# EasyEDA Pro project Project_Hackathon_PCB.epro

# Schematic Main_Board
Create Date: 2024-02-26; Page Name: P1; Project Name: Hackathon; Schematic Name: Main_Board; Update Date: 2024-03-01; Company: HACKATHON; Drawn: EasyEDA; Page Size: A3; Part Number: JLCPCB-002; Reviewed: EasyEDA; Version: V0.1
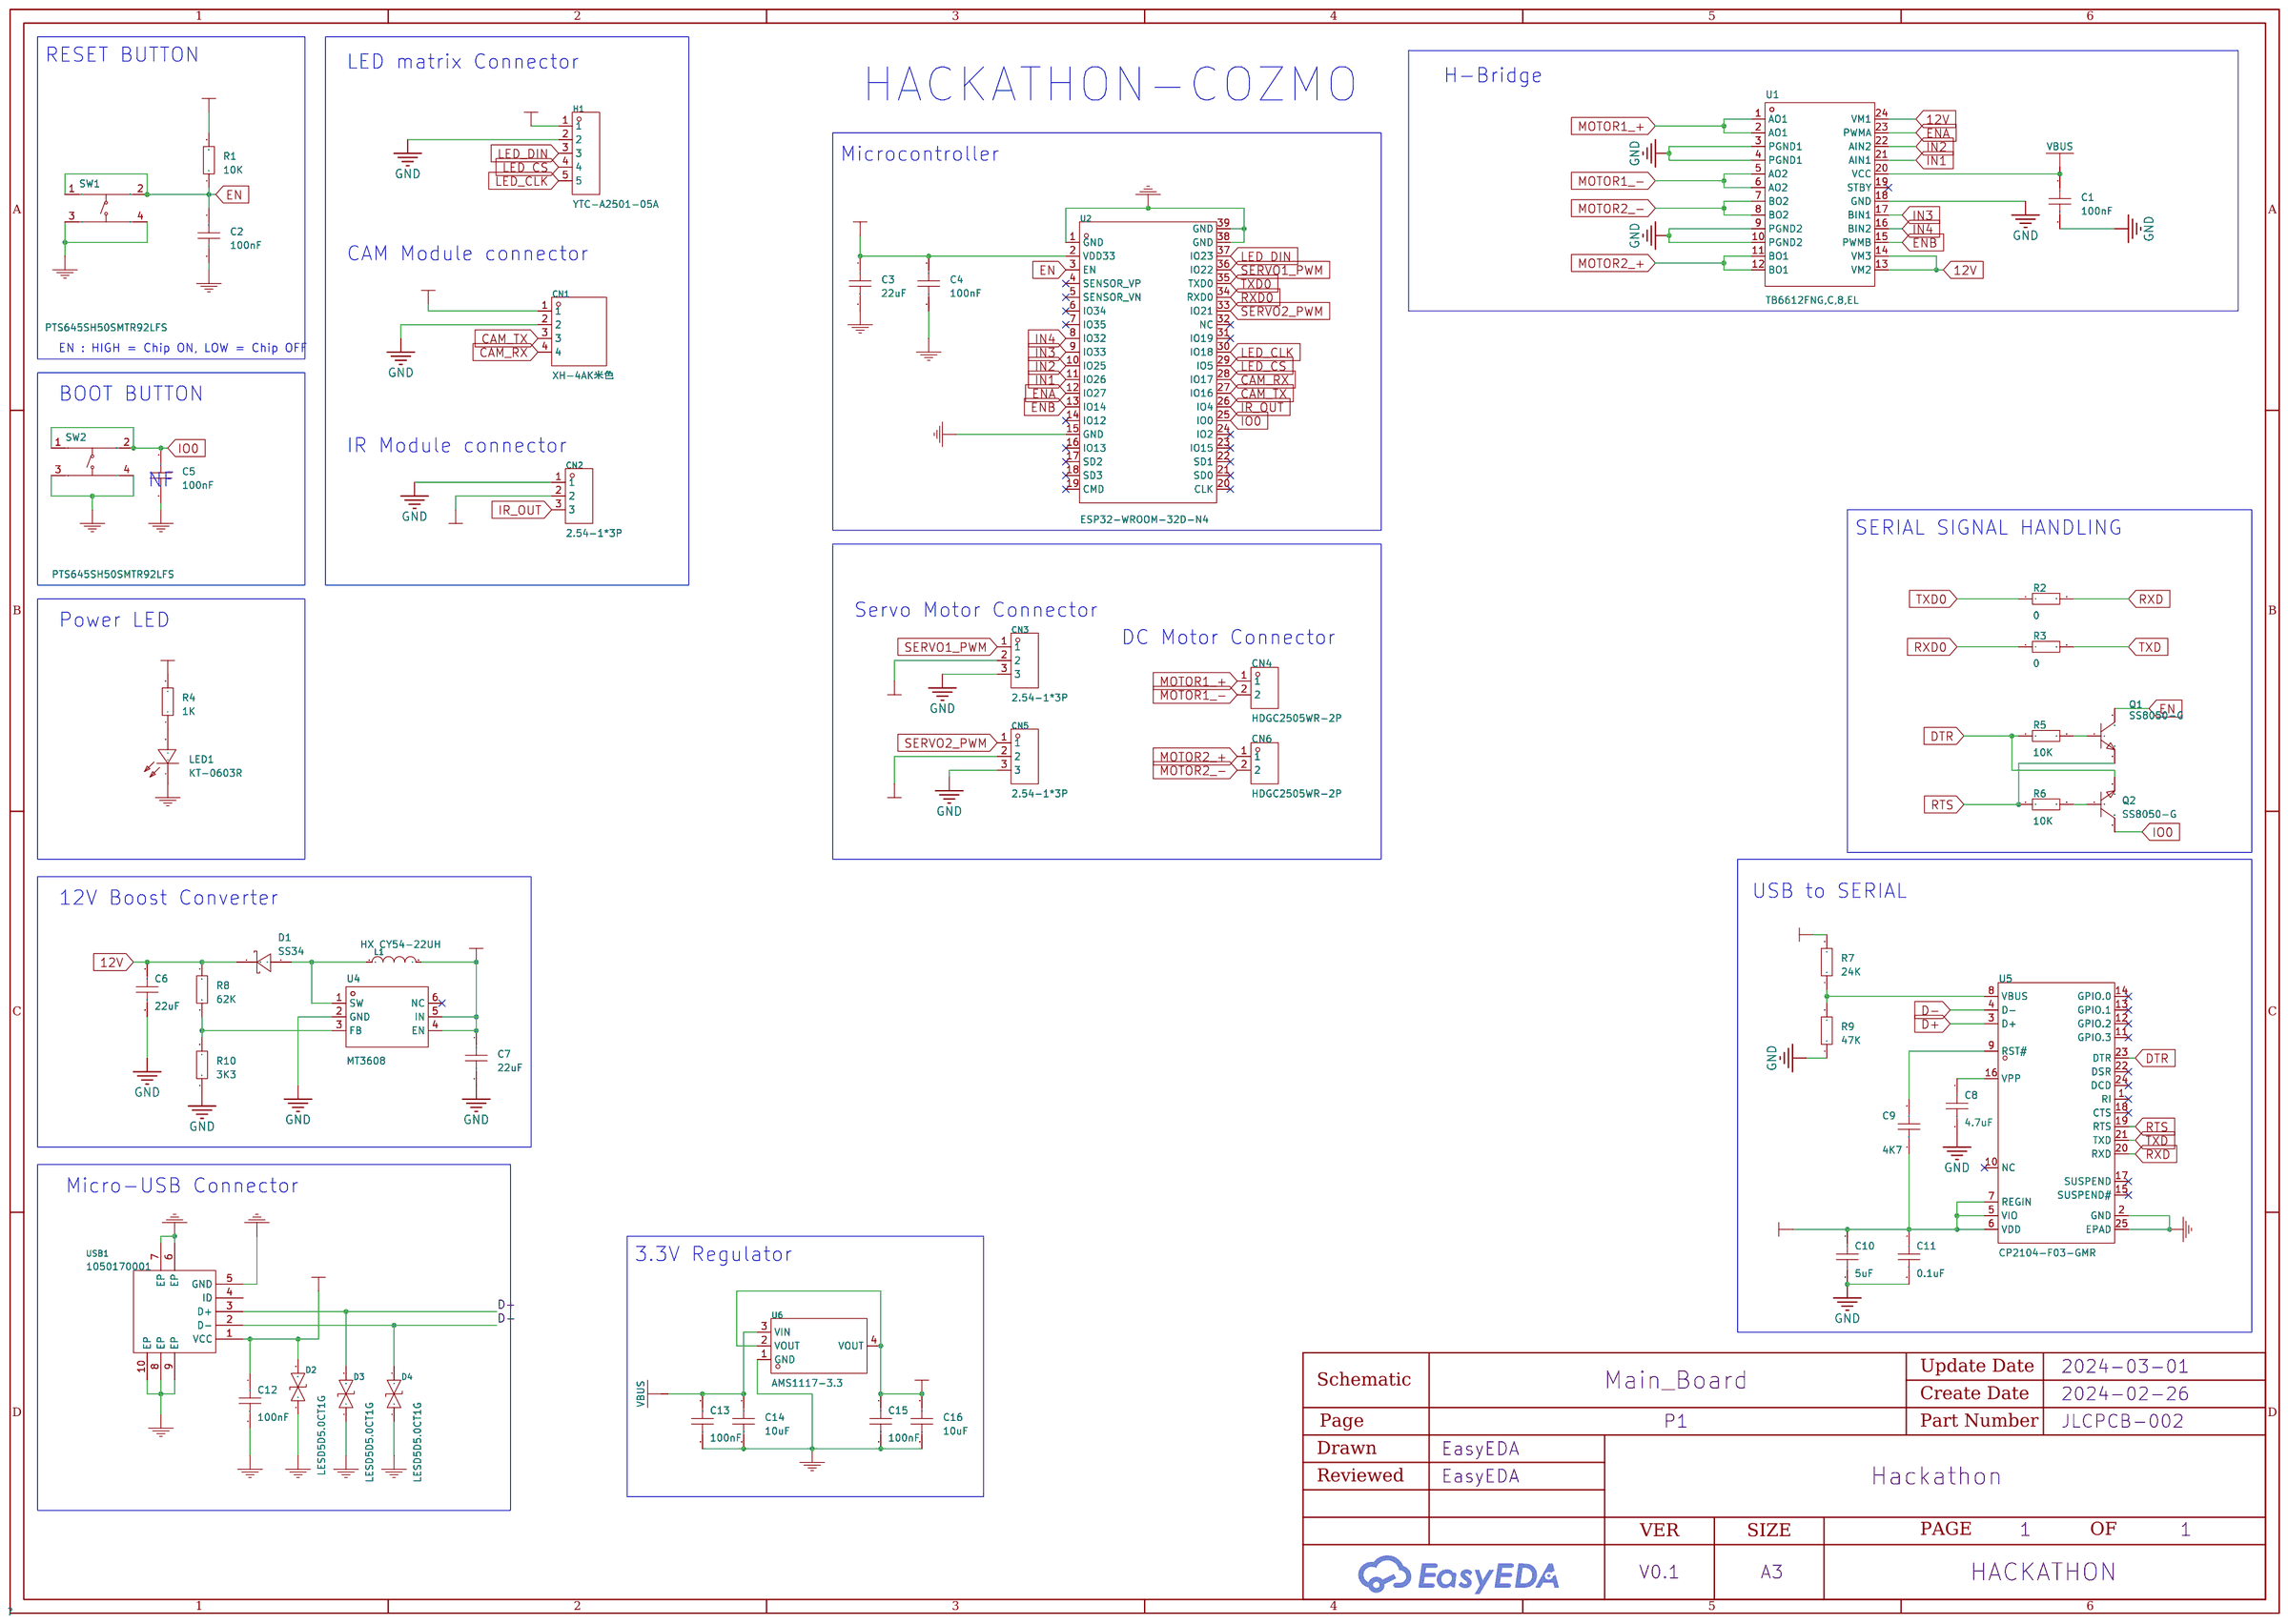
[diagram p0: schematic sheet]

## Parts
C1  100nF  [C0603]
C2  100nF  [C0603]
C3  22uF  [C0603]
C4  100nF  [C0603]
C5  100nF  [C0603]  (no BOM)
C6  22uF  [C0603]
C7  22uF  [C0603]
C8  4.7uF  [C0603]
C9  4K7  [C0603]
C10  5uF  [C0603]
C11  0.1uF  [C0603]
C12  100nF  [C0603]
C13  100nF  [C0603]
C14  10uF  [C0603]
C15  100nF  [C0603]
C16  10uF  [C0603]
CN1  XH-4AK米色  [CONN-TH_4P-P2.50_XH-4A]
CN2  2.54-1*3P  [CONN-TH_C722693]
CN3  2.54-1*3P  [CONN-TH_C722693]
CN4  HDGC2505WR-2P  [CONN-TH_HDGC2505WR-2P]
CN5  2.54-1*3P  [CONN-TH_C722693]
CN6  HDGC2505WR-2P  [CONN-TH_HDGC2505WR-2P]
D1  SS34  [SMC_L6.9-W5.9-LS7.9-RD]
D2  LESD5D5.0CT1G  [SOD-523_L1.2-W0.8-LS1.6-BI]
D3  LESD5D5.0CT1G  [SOD-523_L1.2-W0.8-LS1.6-BI]
D4  LESD5D5.0CT1G  [SOD-523_L1.2-W0.8-LS1.6-BI]
H1  YTC-A2501-05A  [HDR-TH_5P-P2.50-V-F-2]
L1  HX CY54-22UH  [IND-SMD_L5.8-W5.2_SLF05XX]
LED1  KT-0603R  [LED0603-RD]
Q1  SS8050-G  [SOT-23-3_L2.9-W1.3-P1.90-LS2.4-BR]
Q2  SS8050-G  [SOT-23-3_L2.9-W1.3-P1.90-LS2.4-BR]
R1  10K  [R0603]
R2  0  [R0603]
R3  0  [R0603]
R4  1K  [R0603]
R5  10K  [R0603]
R6  10K  [R0603]
R7  24K  [R0603]
R8  62K  [R0603]
R9  47K  [R0603]
R10  3K3  [R0603]
SW1  PTS645SH50SMTR92LFS  [KEY-SMD_4P-L6.0-W6.0-P4.50-LS9.0]
SW2  PTS645SH50SMTR92LFS  [KEY-SMD_4P-L6.0-W6.0-P4.50-LS9.0]
U1  TB6612FNG,C,8,EL  [SSOP-24_L8.3-W5.6-P0.65-LS7.6-BL]
U2  ESP32-WROOM-32D-N4  [WIFIM-SMD_39P-L25.5-W18.0-P1.27-BL]
U4  MT3608  [SOT-23-6_L2.9-W1.6-P0.95-LS2.8-BL]
U5  CP2104-F03-GMR  [QFN-24_L4.0-W4.0-P0.50-BL-EP2.7]
U6  AMS1117-3.3  [SOT-223-3_L6.5-W3.4-P2.30-LS7.0-BR]
USB1  1050170001  [MICRO-USB-SMD_105017-0001]

## Library data of the parts
C1-C16 = CAP_0603: Supplier Footprint: 0603
CN1 = XH-4AK米色: Pins Structure:1x4P Pitch:2.5mm Mounting Style:- Reference Series:XH Number of Pins:4P Number of Rows:1 Number of PINs Per Row:4 Row Spacing:- Contact Material:-; LCSC Part Name: 系列:XH 间距:2.5mm 1x4P; Supplier Part: C146106; Manufacturer: BOOMELE(博穆精密); Supplier Footprint: 插件,P=2.5mm; JLCPCB Part Class: Extended Part; Datasheet: https://atta.szlcsc.com/upload/public/pdf/source/20201225/C146106_214F8CD598ED20EDC5CBB211FD7DC82D.pdf; Supplier: LCSC; Pins Structure: 1x4P; Pitch: 2.5mm; Reference Series: XH; Number of Pins: 4P; Number of Rows: 1; Number of PINs Per Row: 4
CN2 CN3 CN5 = 2.54-1*3P: Pins Structure:1x3P Pitch:2.5mm Mounting Style:Straight Reference Series:- Number of Pins:3P Number of Rows:1 Number of PINs Per Row:3 Row Spacing:- Current Rating (Max):2A Operating Temperature Range:-25℃~+85℃ Operating Temperature Range:-25℃~+85℃; LCSC Part Name: 1x3P 间距:2.5mm 直插; Supplier Part: C722693; Manufacturer: CAX(创都); Supplier Footprint: 插件,P=2.5mm; JLCPCB Part Class: Extended Part; Datasheet: https://atta.szlcsc.com/upload/public/pdf/source/20200828/C722882_77827A18A6E0E346E9D9EABFEFB0E3A6.pdf; Supplier: LCSC; Pins Structure: 1x3P; Pitch: 2.5mm; Mounting Style: Straight; Number of Pins: 3P; Number of Rows: 1; Number of PINs Per Row: 3; Current Rating (Max): 2A; Operating Temperature Range: -25℃~+85℃
CN4 CN6 = HDGC2505WR-2P: Pins Structure:1x2P Mounting Style:Right-Angle Number of Pins:2P Number of Rows:1 Number of PINs Per Row:2; Supplier Part: C5276882; Manufacturer: HDGC(华德共创); Supplier Footprint: 弯插; JLCPCB Part Class: Extended Part; Datasheet: https://atta.szlcsc.com/upload/public/pdf/source/20221125/BC44EB8DA27E74234A82FA1DB1382351.pdf; Supplier: LCSC; Pins Structure: 1x2P; Mounting Style: Right-Angle; Number of Pins: 2P; Number of Rows: 1; Number of PINs Per Row: 2
D1 = SS34_C169162: Forward Voltage (Vf@If):500mV@3A Reverse Voltage (Vr):40V Average Rectified Current (Io):3A; LCSC Part Name: 电压:40V 电流:3A; Supplier Part: C169162; Supplier Footprint: SMC(DO-214AB); JLCPCB Part Class: Extended Part; Datasheet: https://atta.szlcsc.com/upload/public/pdf/source/20180130/C169162_15172974043501323414.pdf; Supplier: LCSC; Forward Voltage (Vf@If): 500mV@3A; Reverse Voltage (Vr): 40V; Average Rectified Current (Io): 3A
D2-D4 = LESD5D5.0CT1G: polarity:Bi-Directional Reverse Stand-Off Voltage (Vrwm):5V Maximum Clamping Voltage:18.6V Peak Pulse Current (Ipp)@10/1000us:9.4A Breakdown Voltage:5.6V Type:ESD; LCSC Part Name: 双向ESD; Supplier Part: C383211; Manufacturer: LRC(乐山无线电); Supplier Footprint: SOD-523; JLCPCB Part Class: Extended Part; Datasheet: https://atta.szlcsc.com/upload/public/pdf/source/20190807/C383211_633DF4B4E2C161403226E5235FE33A1C.pdf; Supplier: LCSC; polarity: Bi-Directional; Reverse Stand-Off Voltage (Vrwm): 5V; Maximum Clamping Voltage: 18.6V; Peak Pulse Current (Ipp)@10/1000us: 9.4A; Breakdown Voltage: 5.6V; Type: ESD
H1 = YTC-A2501-05A: Pins Structure:1x5P Pitch:2.5mm Mounting Style:Straight Reference Series:XH Number of Pins:5P Number of Rows:1 Number of PINs Per Row:5; LCSC Part Name: XH 2.5mm 1x5P直插; Supplier Part: C7436591; Manufacturer: YIYUAN(怡远); Supplier Footprint: P=2.5mm; Datasheet: https://atta.szlcsc.com/upload/public/pdf/source/20230703/1023D4BED328BFC36CE2087683F9B405.pdf; Supplier: LCSC; Pins Structure: 1x5P; Pitch: 2.5mm; Mounting Style: Straight; Reference Series: XH; Number of Pins: 5P; Number of Rows: 1; Number of PINs Per Row: 5
L1 = HX CY54-22UH: LCSC Part Name: 功率/贴片电感 22uH ±10% 直流电阻(DCR):169mΩ 电感值:22uH 精度:±10% 额定电流:1.1A; Supplier Part: C5362904; Manufacturer: hanxia(韩下); Supplier Footprint: SMD; Datasheet: https://atta.szlcsc.com/upload/public/pdf/source/20230221/557EFBE01350101F4F8CD3AD3B454D9E.pdf; Supplier: LCSC
LED1 = KT-0603R: Emitted Color:Red Power Dissipation:- Forward Current:- Dominant Wavelength:- Dominant Wavelength:- Peak Wavelength:- Diode Configuration:- Lens Color:- Color Temperature:- Color Temperature:- Viewing Angle:- Mounting Sytle:- Operating Temperature:-40℃~+8; LCSC Part Name: 0603 红灯 高亮; Supplier Part: C2286; Manufacturer: KENTO; Supplier Footprint: 0603; JLCPCB Part Class: Basic Part; Datasheet: https://atta.szlcsc.com/upload/public/pdf/source/20160616/1466072038404.pdf; Supplier: LCSC; Emitted Color: Red; Operating Temperature: -40℃~+85℃
Q1 Q2 = SS8050-G: Transistor Type: Collector Current (Ic): Collector-Emitter Breakdown Voltage (Vceo): Power Dissipation (Pd): DC Current Gain (hFE@Ic,Vce):200@100mA,1V DC Current Gain (hFE@Ic,Vce):200@100mA,1V Transition Frequency (fT):100MHz Collector Cut-Off Current (Ic; LCSC Part Name: NPN 电流:1.5A 耐压:25V H档(200-350); Supplier Part: C164885; Manufacturer: CJ(江苏长电/长晶); Supplier Footprint: SOT-23; JLCPCB Part Class: Extended Part; Datasheet: https://atta.szlcsc.com/upload/public/pdf/source/20180130/C177739_15172974524031323483.pdf; Supplier: LCSC; DC Current Gain (hFE@Ic,Vce): 200@100mA,1V; Transition Frequency (fT): 100MHz; Collector Cut-Off Current (Icbo): 100nA; Collector-Emitter Saturation Voltage (VCE(sat)@Ic,Ib): 500mV@800mA,80mA
R1-R10 = Res_0603: Supplier Footprint: 0603
SW1 SW2 = PTS645SH50SMTR92LFS: Circuit:SPST Actuator Style:Round Button Operating Force:200gf Mounting Style:Brick nogging Switch Length:6mm Switch Width:6mm Switch Height:5mm Contact Current:50mA Voltage Rating (DC):12V With Lamp:- Pin Style:Gull Wing Mechanical Life:- Operating Tempe; LCSC Part Name: 6*6*5mm 立贴 轻触开关; Supplier Part: C221869; Manufacturer: C&K; Supplier Footprint: SMD,6x6mm; JLCPCB Part Class: Extended Part; Datasheet: https://atta.szlcsc.com/upload/public/pdf/source/20190108/C285530_E89B379DE8DD14E424006A6061D0203A.pdf; Supplier: LCSC; Circuit: SPST; Actuator Style: Round Button; Operating Force: 200gf; Mounting Style: Brick nogging; Switch Length: 6mm; Switch Width: 6mm; Switch Height: 5mm; Contact Current: 50mA; Voltage Rating (DC): 12V; Pin Style: Gull Wing; Operating Temperature: -40℃~+85℃
U1 = TB6612FNG,C,8,EL: Drive motor type:有刷直流电机 Supply Voltage:2.7V~5.5V Supply Voltage:2.7V~5.5V Output Current:1A Interface:Parallel Operating Temperature:-20℃~+85℃@(Ta) Operating Temperature:-20℃~+85℃@(Ta); LCSC Part Name: 1A 有刷直流电机驱动芯片 5.5V; Supplier Part: C141517; Manufacturer: TOSHIBA(东芝); Supplier Footprint: SSOP-24; JLCPCB Part Class: Extended Part; Datasheet: https://atta.szlcsc.com/upload/public/pdf/source/20171128/C141517_15118625624231147036.pdf; Supplier: LCSC; Drive motor type: 有刷直流电机; Supply Voltage: 2.7V~5.5V; Output Current: 1A; Interface: Parallel; Operating Temperature: -20℃~+85℃@(Ta)
U2 = ESP32-WROOM-32D-N4: LCSC Part Name: 通用型Wi-Fi+BT+BLE MCU模组; Supplier Part: C473012; Manufacturer: ESPRESSIF(乐鑫); Supplier Footprint: SMD,18x25.5mm; JLCPCB Part Class: Extended Part; Datasheet: https://atta.szlcsc.com/upload/public/pdf/source/20191225/C473012_1E74417EE995DBCF17C94BD318A37DAB.pdf; Supplier: LCSC
U4 = MT3608: Function:boost converterType Input Voltage:2V~24V Input Voltage:2V~24V Output Voltage:28V Output Voltage:28V Output Current (Max):- Switching Frequency:1.2MHz Synchronous Rectification:- Number of Outputs:1 Topology:Boost Switch tube (built-in/external):内; Supplier Part: C84817; Manufacturer: 西安航天民芯; Supplier Footprint: SOT-23-6; JLCPCB Part Class: Extended Part; Datasheet: https://atta.szlcsc.com/upload/public/pdf/source/20161110/1478743351706.pdf; Supplier: LCSC; Function: boost converterType; Input Voltage: 2V~24V; Output Voltage: 28V; Switching Frequency: 1.2MHz; Number of Outputs: 1; Topology: Boost; Switch tube (built-in/external): 内置
U5 = CP2104-F03-GMR_C47742: Applications Function:USB转UART Protocol:UART Supply Voltage:1.8V；3V~3.6V Supply Voltage:1.8V；3V~3.6V Data Rate:2Mbps Operating Temperature:-40℃~+85℃ Operating Temperature:-40℃~+85℃; LCSC Part Name: USB转UART桥接芯片; Supplier Part: C47742; Manufacturer: SKYWORKS/SILICON LABS(芯科); Supplier Footprint: QFN-24-EP(4x4); JLCPCB Part Class: Extended Part; Datasheet: https://atta.szlcsc.com/upload/public/pdf/source/20150504/1457707282429.pdf; Supplier: LCSC; Applications Function: USB转UART; Protocol: UART; Supply Voltage: 1.8V；3V~3.6V; Data Rate: 2Mbps; Operating Temperature: -40℃~+85℃
U6 = AMS1117-3.3_C6186: Output Type: Maximum Input Voltage:- Output Voltage:3.3V Output Voltage:3.3V MAX Output Current:1A Power Supply Rejection Ratio (PSRR):72dB@(120Hz) Dropout Voltage:1.3V@(800mA) standby current:- Noise:- Feature:- Operating Temperature:- Operating Temperat; LCSC Part Name: 输出3.3V 1A; Supplier Part: C6186; Manufacturer: AMS; Supplier Footprint: SOT-223-3; JLCPCB Part Class: Basic Part; Datasheet: https://atta.szlcsc.com/upload/public/pdf/source/20180727/C6186_7A095716F0823C02F1997A905E26C086.pdf; Supplier: LCSC; Output Voltage: 3.3V; MAX Output Current: 1A; Power Supply Rejection Ratio (PSRR): 72dB@(120Hz); Dropout Voltage: 1.3V@(800mA); Output Polarity: Positive electrode; Number of Outputs: 1
USB1 = 1050170001: Connector Type:Micro-B Standard:USB 2.0 Gender:Female Number of Ports:1 Number of Contacts:5P Mounting Style:卧贴 Current Rating - Power (Max):- Operating Temperature Range:-30℃~+85℃ Operating Temperature Range:-30℃~+85℃; LCSC Part Name: Micro-B 母 卧贴; Supplier Part: C136000; Manufacturer: MOLEX; Supplier Footprint: SMD; JLCPCB Part Class: Extended Part; Datasheet: https://atta.szlcsc.com/upload/public/pdf/source/20171113/C136000_15105610884381115465.pdf; Supplier: LCSC; Connector Type: Micro-B; Standard: USB 2.0; Gender: Female; Number of Ports: 1; Number of Contacts: 5P; Mounting Style: 卧贴; Operating Temperature Range: -30℃~+85℃

## Nets
12V: C6.1 D1.1(C) R8.2 U1.13(VM2) U1.14(VM3) U1.24(VM1)
+3V3: C3.1 C4.1 C9.1 C10.1 C11.1 C15.1 C16.1 H1.1 R1.2 R4.2 U2.2(VDD33) U5.5(VIO) U5.6(VDD) U5.7(REGIN) U6.2(VOUT) U6.4(VOUT)
GND: C1.2 C2.2 C3.2 C4.2 C5.2 C6.2 C7.2 C8.2 C10.2 C11.2 C12.2 C13.2 C14.2 C15.2 C16.2 CN1.2 CN2.1 CN3.3 CN5.3 D2.1 D3.1 D4.1 H1.2 LED1.1(K) R9.1 R10.1 SW1.3 SW1.4 SW2.3 SW2.4 U1.3(PGND1) U1.4(PGND1) U1.9(PGND2) U1.10(PGND2) U1.18(GND) U2.1(GND) U2.15(GND) U2.38(GND) U2.39(GND) U4.2(GND) U5.2(GND) U5.25(EPAD) U6.1(GND) USB1.5(GND) USB1.6(EP) USB1.7(EP) USB1.8(EP) USB1.9(EP) USB1.10(EP)
VBUS: C1.1 C7.1 C12.1 C13.1 C14.1 CN1.1 CN2.2 CN3.2 CN5.2 D2.2 L1.2 R7.2 U1.20(VCC) U4.4(EN) U4.5(IN) U6.3(VIN) USB1.1(VCC)
CAM_RX: CN1.4 U2.28(IO17)
CAM_TX: CN1.3 U2.27(IO16)
D+: D3.2 U5.3(D+) USB1.3(D+)
D-: D4.2 U5.4(D-) USB1.2(D-)
DTR: Q2.2(E) R5.1 U5.23(DTR)
EN: C2.1 Q1.3(C) R1.1 SW1.1 SW1.2 U2.3(EN)
ENA: U1.23(PWMA) U2.12(IO27)
ENB: U1.15(PWMB) U2.13(IO14)
IN1: U1.21(AIN1) U2.11(IO26)
IN2: U1.22(AIN2) U2.10(IO25)
IN3: U1.17(BIN1) U2.9(IO33)
IN4: U1.16(BIN2) U2.8(IO32)
IO0: C5.1 Q2.3(C) SW2.1 SW2.2 U2.25(IO0)
IR_OUT: CN2.3 U2.26(IO4)
LED_CLK: H1.5 U2.30(IO18)
LED_CS: H1.4 U2.29(IO5)
LED_DIN: H1.3 U2.37(IO23)
MOTOR1_+: CN4.1 U1.1(AO1) U1.2(AO1)
MOTOR1_-: CN4.2 U1.5(AO2) U1.6(AO2)
MOTOR2_+: CN6.1 U1.11(BO1) U1.12(BO1)
MOTOR2_-: CN6.2 U1.7(BO2) U1.8(BO2)
RTS: Q1.2(E) R6.1 U5.19(RTS)
RXD: R2.2 U5.20(RXD)
RXD0: R3.1 U2.34(RXD0)
SERVO1_PWM: CN3.1 U2.36(IO22)
SERVO2_PWM: CN5.1 U2.33(IO21)
TXD: R3.2 U5.21(TXD)
TXD0: R2.1 U2.35(TXD0)
$1N12848: Q1.1(B) R5.2
$1N12849: Q2.1(B) R6.2
$1N16217: R7.1 R9.2 U5.8(VBUS)
$1N16236: C9.2 U5.9(RST#)
$1N16284: C8.1 U5.16(VPP)
$1N18974: R8.1 R10.2 U4.3(FB)
$1N19007: D1.2(A) L1.1 U4.1(SW)
$1N24133: LED1.2(A) R4.1

Not connected (* = marked no-connect by the designer): U1 19(STBY)*; U2 4(SENSOR_VP)* 5(SENSOR_VN)* 6(IO34)* 7(IO35)* 14(IO12)* 16(IO13)* 17(SD2)* 18(SD3)* 19(CMD)* 20(CLK)* 21(SD0)* 22(SD1)* 23(IO15)* 24(IO2)* 31(IO19)* 32(NC)*; U4 6(NC)*; U5 1(RI)* 10(NC)* 11(GPIO.3)* 12(GPIO.2)* 13(GPIO.1)* 14(GPIO.0)* 15(SUSPEND#)* 17(SUSPEND)* 18(CTS)* 22(DSR)* 24(DCD)*; USB1 4(ID)

## Notes on the sheet
- RESET BUTTON
- LED matrix Connector
- H-Bridge
- HACKATHON-COZMO
- Microcontroller
- CAM Module connector
- EN : HIGH = Chip ON, LOW = Chip OFF
- BOOT BUTTON
- IR Module connector
- NF
- SERIAL SIGNAL HANDLING
- Power LED
- Servo Motor Connector
- DC Motor Connector
- 12V Boost Converter
- USB to SERIAL
- Micro-USB Connector
- 3.3V Regulator

# Board Full Board
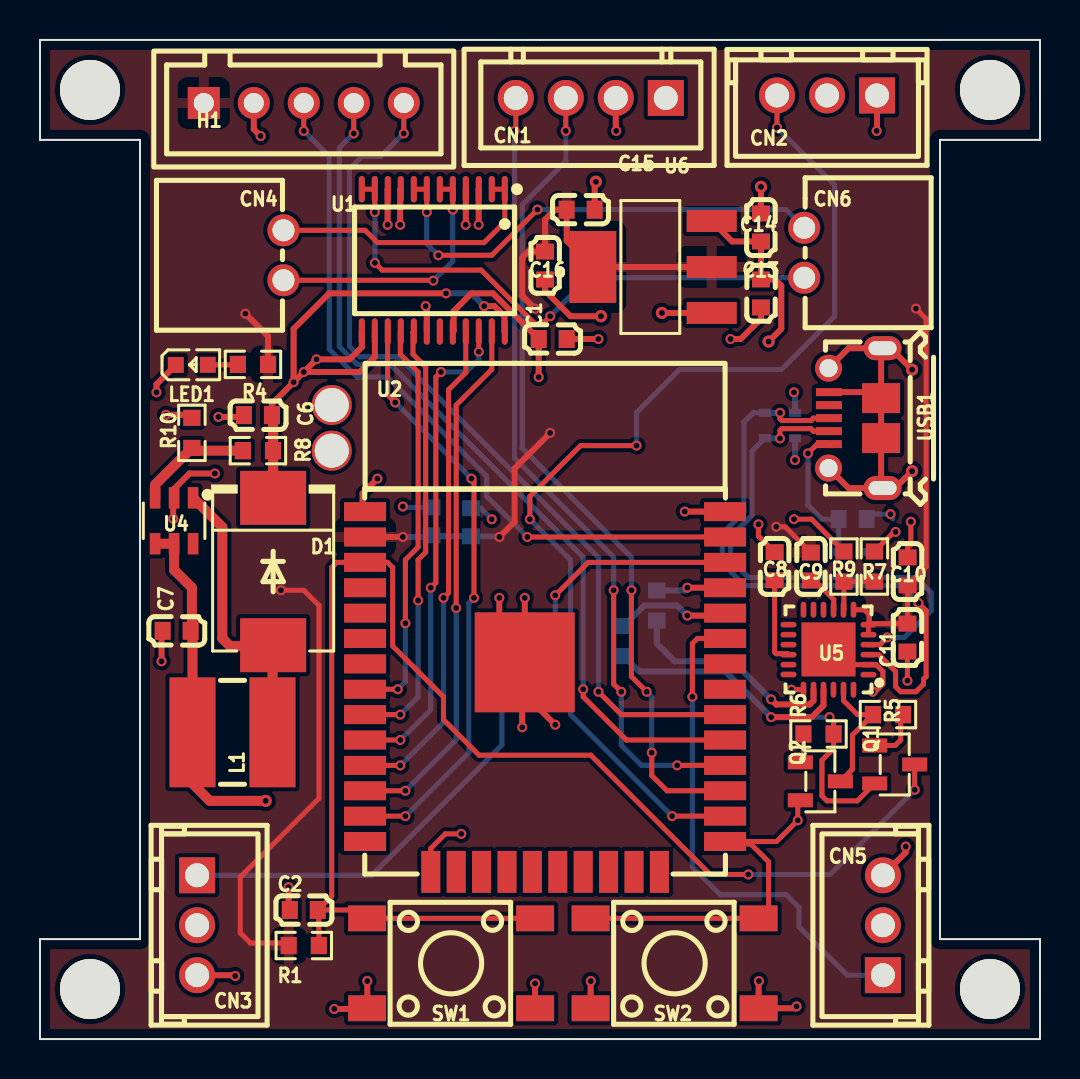
[diagram p1: board, top side]
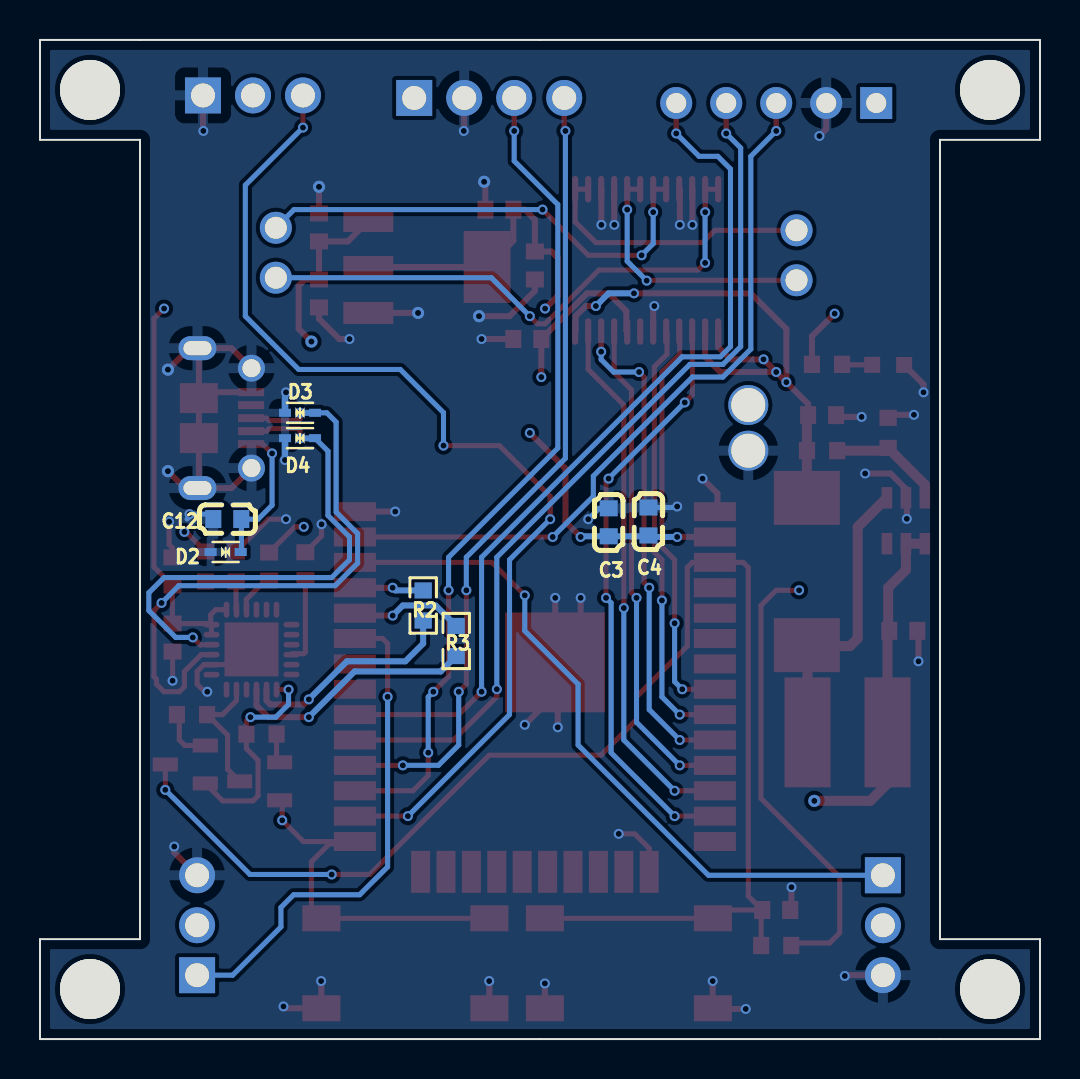
[diagram p2: board, bottom side, seen from below]

Outline 50 x 50 mm; copper layers: Top Layer, GND, PWR, Bottom Layer. Coordinates in mm from the lower left corner of the outline.
Outline path: 0,50 0,45 5,45 5,5 0,5 0,0 50,0 50,5 45,5 45,45 50,45 50,50 0,50
Stack: Top Layer 0.035mm 外层铜厚1oz / Dielectric1 0.2104mm 7628 RC49% 8.6mil / GND 0.0152mm 内层铜厚 / Dielectric2 1.065mm 1.1mm H/HOZ 含铜 / PWR 0.0152mm 内层铜厚 / Dielectric3 0.2104mm 7628 RC49% 8.6mil / Bottom Layer 0.035mm 外层铜厚1oz

## Design rules (mm)
template: JLCPCB Capability(Two Layers Board)
spacing copperThickness1oz (default): track to track 0.102, other pairs 0.152 to 0.3
spacing copperThickness2oz: track to track 0.203, other pairs 0.152 to 0.3
track width copperThickness1oz (default): min 0.127, default 0.254, max 2.54
track width copperThickness2oz: min 0.203, default 0.254, max 2.54
differential pair differentialPair (default): width min 0.127, default 0.254, max 2.54; gap min 0.152, default 0.152
via viaSize (default): diameter min 0.5, default 0.61, max 10; hole min 0.3, default 0.305, max 6.3

## Placement (name value [footprint] x y rotation side)
C1  100nF  [C0603]  25.63 35.03 0 top
C2  100nF  [C0603]  13.19 6.46 180 top
C3  22uF  [C0603]  21.56 25.86 90 bottom
C4  100nF  [C0603]  19.58 25.9 90 bottom
C6  22uF  [C0603]  10.9 31.22 180 top
C7  22uF  [C0603]  6.83 20.43 180 top
C8  4.7uF  [C0603]  36.73 23.66 90 top
C9  4K7  [C0603]  38.55 23.65 270 top
C10  5uF  [C0603]  43.38 23.41 90 top
C11  0.1uF  [C0603]  43.37 20.09 270 top
C12  100nF  [C0603]  40.64 26.02 0 bottom
C13  100nF  [C0603]  36.05 37.31 270 top
C14  10uF  [C0603]  36.05 40.62 90 top
C15  100nF  [C0603]  27.03 41.51 0 top
C16  10uF  [C0603]  25.25 38.71 270 top
CN1  XH-4AK米色  [CONN-TH_4P-P2.50_XH-4A]  27.54 47.1 180 top
CN2  2.54-1*3P  [CONN-TH_C722693]  39.35 47.22 180 top
CN3  2.54-1*3P  [CONN-TH_C722693]  7.86 5.7 270 top
CN4  HDGC2505WR-2P  [CONN-TH_HDGC2505WR-2P]  12.17 39.22 270 top
CN5  2.54-1*3P  [CONN-TH_C722693]  42.15 5.7 90 top
CN6  HDGC2505WR-2P  [CONN-TH_HDGC2505WR-2P]  38.21 39.35 90 top
D1  SS34  [SMC_L6.9-W5.9-LS7.9-RD]  11.66 23.4 270 top
D2  LESD5D5.0CT1G  [SOD-523_L1.2-W0.8-LS1.6-BI]  40.72 24.37 180 bottom
D3  LESD5D5.0CT1G  [SOD-523_L1.2-W0.8-LS1.6-BI]  37 31.34 180 bottom
D4  LESD5D5.0CT1G  [SOD-523_L1.2-W0.8-LS1.6-BI]  37 30.07 180 bottom
H1  YTC-A2501-05A  [HDR-TH_5P-P2.50-V-F-2]  13.19 46.84 0 top
L1  HX CY54-22UH  [IND-SMD_L5.8-W5.2_SLF05XX]  9.63 15.35 180 top
LED1  KT-0603R  [LED0603-RD]  7.59 33.74 0 top
NOREF  -  [Pad_e332]  14.59 29.44 0 top
NOREF#2  -  [Pad_e4358]  47.5 2.5 0 top
NOREF#3  -  [Pad_e331]  14.59 31.73 0 top
NOREF#4  -  [Pad_e4357]  47.5 47.5 0 top
NOREF#5  -  [Pad_e4356]  2.5 47.5 0 top
NOREF#6  -  [Pad_e4359]  2.5 2.5 0 top
Q1  SS8050-G  [SOT-23-3_L2.9-W1.3-P1.90-LS2.4-BR]  42.74 13.74 180 top
Q2  SS8050-G  [SOT-23-3_L2.9-W1.3-P1.90-LS2.4-BR]  39.02 12.9 180 top
R1  10K  [R0603]  13.19 4.68 180 top
R2  0  [R0603]  30.84 21.7 270 bottom
R3  0  [R0603]  29.19 19.92 270 bottom
R4  1K  [R0603]  10.65 33.76 0 top
R5  10K  [R0603]  42.4 16.24 0 top
R6  10K  [R0603]  38.93 15.26 180 top
R7  24K  [R0603]  41.72 23.65 90 top
R8  62K  [R0603]  10.9 29.45 0 top
R9  47K  [R0603]  40.2 23.65 270 top
R10  3K3  [R0603]  7.59 30.33 270 top
SW1  PTS645SH50SMTR92LFS  [KEY-SMD_4P-L6.0-W6.0-P4.50-LS9.0]  20.56 3.79 0 top
SW2  PTS645SH50SMTR92LFS  [KEY-SMD_4P-L6.0-W6.0-P4.50-LS9.0]  31.73 3.79 0 top
U1  TB6612FNG,C,8,EL  [SSOP-24_L8.3-W5.6-P0.65-LS7.6-BL]  19.67 38.97 180 top
U2  ESP32-WROOM-32D-N4  [WIFIM-SMD_39P-L25.5-W18.0-P1.27-BL]  25.25 17.38 270 top
U4  MT3608  [SOT-23-6_L2.9-W1.6-P0.95-LS2.8-BL]  6.71 25.94 180 top
U5  CP2104-F03-GMR  [QFN-24_L4.0-W4.0-P0.50-BL-EP2.7]  39.43 19.49 90 top
U6  AMS1117-3.3  [SOT-223-3_L6.5-W3.4-P2.30-LS7.0-BR]  30.61 38.64 0 top
USB1  1050170001  [MICRO-USB-SMD_105017-0001]  40.78 31.07 90 top

## Footprints (pads in the part's own frame, mm; a bottom-side part is the same pattern mirrored in y, then rotated)
C0603
  rect 0.8x0.9 smd: 1(-0.7,0) 2(0.7,0)
CONN-TH_4P-P2.50_XH-4A
  rect 1.8x1.8 hole 1.199: 1(-3.751,0)
  round 1.8 hole 1.199: 2(-1.25,0) 3(1.25,0) 4(3.751,0)
CONN-TH_C722693
  rect 1.8x1.8 hole 1.2: 1(-2.5,0)
  round 1.8 hole 1.2: 2(0,0) 3(2.5,0)
CONN-TH_HDGC2505WR-2P
  round 1.6 hole 1.1: 1(-1.25,0) 2(1.25,0)
HDR-TH_5P-P2.50-V-F-2
  rect 1.6x1.6 hole 1: 1(-5,0)
  round 1.6 hole 1: 2(-2.5,0) 3(0,0) 4(2.5,0) 5(5,0)
IND-SMD_L5.8-W5.2_SLF05XX
  rect 2.3x5.5 smd: 1(-2,0) 2(2,0)
KEY-SMD_4P-L6.0-W6.0-P4.50-LS9.0
  rect 1.9x1.3 smd: 1(-4.2,2.25) 2(4.2,2.25) 3(-4.2,-2.25) 4(4.2,-2.25)
LED0603-RD
  rect 0.8x0.8 smd: 1(-0.799,-0.004) 2(0.799,0.004)
MICRO-USB-SMD_105017-0001
  rect 0.4x1.3 smd: 1(-1.3,1.33) 2(-0.65,1.33) 3(0,1.33) 4(0.65,1.33) 5(1.3,1.33)
  round 1.35 hole 0.9: 6(-2.5,1.35) 7(2.5,1.35)
  oval 1.2x1.9 hole 0.7x1.4: 8(3.5,-1.35) 9(-3.5,-1.35)
  rect 1.5x1.9 smd: 10(-1,-1.28) 10(1,-1.28)
Pad_e331
  round 2 hole 1.7: 44(0,0)
Pad_e332
  round 2 hole 1.7: 45(0,0)
Pad_e4356
  round 3 hole 3: 40(0,0)
Pad_e4357
  round 3 hole 3: 41(0,0)
Pad_e4358
  round 3 hole 3: 42(0,0)
Pad_e4359
  round 3 hole 3: 43(0,0)
QFN-24_L4.0-W4.0-P0.50-BL-EP2.7
  oval 0.28x0.8 smd: 1(-1.25,-2) 2(-0.75,-2) 3(-0.25,-2) 4(0.25,-2) 5(0.75,-2) 6(1.25,-2) 13(1.25,2) 14(0.75,2) 15(0.25,2) 16(-0.25,2) 17(-0.75,2) 18(-1.242,2)
  oval 0.8x0.28 smd: 7(2,-1.25) 8(2,-0.75) 9(2,-0.25) 10(2,0.25) 11(2,0.75) 12(2,1.25) 19(-2,1.25) 20(-2,0.75) 21(-2,0.25) 22(-2,-0.25) 23(-2,-0.75) 24(-2,-1.25)
  rect 2.7x2.7 smd: 25(0.013,0)
R0603
  rect 0.806x0.864 smd: 1(-0.753,0) 2(0.753,0)
SMC_L6.9-W5.9-LS7.9-RD
  rect 2.7x3.3 smd: 1(-3.687,0) 2(3.687,0)
SOD-523_L1.2-W0.8-LS1.6-BI
  rect 0.6x0.4 smd: 1(-0.75,0) 2(0.75,0)
SOT-23-3_L2.9-W1.3-P1.90-LS2.4-BR
  rect 1.25x0.7 smd: 1(1,-0.95) 2(1,0.95) 3(-1,0)
SOT-23-6_L2.9-W1.6-P0.95-LS2.8-BL
  rect 0.532x1.072 smd: 1(-0.95,-1.149) 2(0,-1.149) 3(0.95,-1.149) 4(0.95,1.149) 5(0,1.149) 6(-0.95,1.149)
SOT-223-3_L6.5-W3.4-P2.30-LS7.0-BR
  rect 2.5x1.1 smd: 1(2.97,-2.3) 2(2.97,0) 3(2.97,2.3)
  rect 2.34x3.6 smd: 4(-2.97,0)
SSOP-24_L8.3-W5.6-P0.65-LS7.6-BL
  oval 0.308x1.324 smd: 1(-3.575,-3.562) 2(-2.925,-3.562) 3(-2.275,-3.562) 4(-1.625,-3.562) 5(-0.975,-3.562) 6(-0.325,-3.562) 7(0.325,-3.562) 8(0.975,-3.562) 9(1.625,-3.562) 10(2.275,-3.562) 11(2.925,-3.562) 12(3.575,-3.562) 13(3.575,3.562) 14(2.925,3.562) 15(2.275,3.562) 16(1.625,3.562) 17(0.975,3.562) 18(0.325,3.562) 19(-0.325,3.562) 20(-0.975,3.562) 21(-1.625,3.562) 22(-2.275,3.562) 23(-2.925,3.562) 24(-3.575,3.562)
WIFIM-SMD_39P-L25.5-W18.0-P1.27-BL
  rect 0.95x2.1 smd: 1(-9.015,-9) 2(-7.745,-9) 3(-6.475,-9) 4(-5.205,-9) 5(-3.935,-9) 6(-2.665,-9) 7(-1.395,-9) 8(-0.125,-9) 9(1.145,-9) 10(2.415,-9) 11(3.685,-9) 12(4.955,-9) 13(6.225,-9) 14(7.495,-9) 25(7.495,9) 26(6.225,9) 27(4.955,9) 28(3.685,9) 29(2.415,9) 30(1.145,9) 31(-0.125,9) 32(-1.395,9) 33(-2.665,9) 34(-3.935,9) 35(-5.205,9) 36(-6.475,9) 37(-7.745,9) 38(-9.015,9)
  rect 2.1x0.95 smd: 15(9.015,-5.715) 16(9.015,-4.445) 17(9.015,-3.175) 18(9.015,-1.905) 19(9.015,-0.635) 20(9.015,0.635) 21(9.015,1.905) 22(9.015,3.175) 23(9.015,4.445) 24(9.015,5.715)
  rect 5x5 smd: 39(-1.472,-1.017)

## Nets
As in the schematic, except:
GND: C1.2 C2.2 C3.2 C4.2 C6.2 C7.2 C8.2 C10.2 C11.2 C12.2 C13.2 C14.2 C15.2 C16.2 CN1.2 CN2.1 CN3.3 CN5.3 D2.1 D3.1 D4.1 H1.2 LED1.1 NOREF.45 R9.1 R10.1 SW1.3 SW1.4 SW2.3 SW2.4 U1.3 U1.4 U1.9 U1.10 U1.18 U2.1 U2.15 U2.38 U2.39 U4.2 U5.2 U5.25 U6.1 USB1.5 USB1.6 USB1.7 USB1.8 USB1.9 USB1.10
VBUS: C1.1 C7.1 C12.1 C13.1 C14.1 CN1.1 CN2.2 CN3.2 CN5.2 D2.2 L1.2 NOREF#3.44 R7.2 U1.20 U4.4 U4.5 U6.3 USB1.1
DTR: Q2.3 R5.1 U5.23
IO0: Q2.2 SW2.1 SW2.2 U2.25

Pads without a net: NOREF#2 42; NOREF#4 41; NOREF#5 40; NOREF#6 43; U1 19; U2 4 5 6 7 14 16 17 18 19 20 21 22 23 24 31 32; U4 6; U5 1 10 11 12 13 14 15 17 18 22 24; USB1 4

## Via types
v1: diameter 0.61, hole 0.305, Top Layer to Bottom Layer, 8 vias
v2: diameter 0.5, hole 0.3, Top Layer to Bottom Layer, 115 vias

## Routing (per net, layer and track width the routed paths; a pad name or vN(x,y) marks a point on that pad's centre or on a via; arc(x,y) is an arc through that point)
12V: length 31.5
  Top Layer w0.3: v2(13.19,33.38) v2(13.82,34.02) 15.47,34.02 16.09,34.63 U1.13 ; v2(13.19,33.38) v2(12.68,32.87) ; v2(13.19,33.38) 15.98,33.38 16.75,34.14 16.75,35.4 U1.14 ; v2(12.68,32.87) 11.6,31.79 C6.1 ; v2(12.68,32.87) 12.68,35.54 14.46,37.32 v2(20.3,37.32) ; v2(22.21,36.68) 22.71,36.68 23.22,36.18 23.22,35.43 U1.24
  Top Layer w0.5: 11.66,29.44 11.66,31.16 C6.1 ; 11.66,29.44 R8.2 ; 11.66,29.44 D1.1
  Bottom Layer w0.3: v2(20.3,37.32) 21.57,37.32 v2(22.21,36.68)
+3V3: length 77.7
  Top Layer w0.254: U5.7 41.21,21.49 41.47,21.23 41.47,20.78 ; v2(12.05,22.46) 13.19,22.46 13.95,21.7 13.95,12.05 10.01,8.11 10.01,5.31 10.52,4.81 12.31,4.81 R1.2 ; 41.47,20.78 U5.6 U5.5 ; 41.47,20.78 41.48,20.79 C11.1 43.38,20.8 C10.1 44.3,23.63 44.3,36.05 v2(43.8,36.56) ; C9.1 37.26,25.63 v2(36.81,25.63)
  Top Layer w0.3: 16.25,25.13 v2(18.14,25.13) ; U6.2 U6.4 26.33,39.95 C15.1 25.76,41.51 25.25,41 C16.1 24.43,39.41 24.11,39.1 24.11,37.19 v2(24.75,36.56) ; v2(10.27,36.3) 11.4,35.17 R4.2 ; v2(22.97,25.13) 23.73,25.89 23.73,28.56 v2(25.51,30.33)
  Bottom Layer w0.3: v2(18.14,25.13) 19.5,25.13 C4.1 19.62,25.16 C3.1 22.93,25.16 v2(22.97,25.13)
GND: length 110.4
  Top Layer w0.254: 19.54,8.36 19.54,9.54 20.27,10.27 v2(21.06,10.27) ; v2(41.64,17.38) 41.76,17.38 42.15,17.76 42.15,18.4 41.8,18.74 U5.2 40.19,18.74 U5.25 ; v2(43.54,25.89) 43.54,24.75 43.38,24.58 C10.2 ; v2(37.7,26.02) 38.58,26.02 R9.1 ; v2(35.92,25.76) 35.92,25.17 C8.2 ; C11.2 v2(43.37,17.93)
  Top Layer w0.3: U1.9 18.01,42.5 v2(18.01,40.75) ; CN1.2 28.79,45.47 v2(28.81,45.45) ; USB1.7 40.43,34.57 USB1.8 ; H1.2 10.69,45.53 v2(11.03,45.19) ; v2(37.83,1.63) 37.74,1.54 35.93,1.54 35.93,2.89 v2(35.95,2.9) ; CN5.3 43.29,9.34 v2(43.29,9.63) ; v1(27.79,42.9) 27.73,42.84 C15.2 ; USB1.10 USB1.10 42.06,27.64 USB1.9 ; USB1.10 42.06,34.5 USB1.8 ; USB1.10 41.76,32.37 USB1.5 ; v2(5.82,32.37) 5.82,32.77 LED1.1 ; v2(32.24,26.4) 34.12,26.4 34.13,26.39 ; CN2.1 41.85,45.47 v2(41.83,45.45) ; 16.13,26.39 16.13,27.3 v2(16.87,28.05) ; U6.1 v1(31.1,36.34) ; C13.2 36.05,36.05 35.03,35.03 v2(34.53,35.03) ; CN3.3 9.72,3.2 v2(9.76,3.16) ; v2(8.92,31.13) 10.11,31.13 C6.2 ; v2(12.43,7.6) 12.43,6.52 C2.2 ; 25.25,38.01 25.25,37.45 26.52,36.18 v1(28.05,36.18) ; v1(43.6,33.5) 42.53,34.57 USB1.8 ; v2(21.93,40.75) 21.93,42.52 U1.3 ; 24.11,17.38 24.11,18.85 ; 24.11,18.85 22.97,19.99 v2(22.97,22.08) ; 24.11,18.85 24.24,18.98 v2(24.24,22.08) ; USB1.6 40.43,27.57 USB1.9 ; v2(8.74,28.3) 7.47,28.3 6.71,27.53 U4.2 6.66,27.04 v2(6.66,26.03) ; v2(14.71,1.5) 16.32,1.5 SW1.3 16.36,1.55 v2(16.36,2.9) ; 24.11,17.38 24.11,18.85 ; 24.11,17.38 v2(24.11,15.6) ; 24.11,17.38 v2(25.76,15.73) ; U1.18 19.34,36.63 v2(19.28,36.68) ; U1.4 21.29,40.75 v2(21.28,40.75) ; v2(6.3,31.24) 7.44,31.24 R10.1 ; C7.2 6.08,20.37 v2(6.08,18.9) ; v2(17.38,40.75) 17.38,42.52 U1.10 ; SW2.3 27.53,2.89 v2(27.54,2.9) ; USB1.9 42.76,27.57 v1(43.6,28.42) ; 26.34,35.03 v2(27.92,35.03) ; C14.2 v1(36.05,42.65) ; SW1.4 v2(24.75,2.78)
  Bottom Layer w0.254: v2(22.59,26.02) 22.04,26.56 C3.2 ; 42.65,26.02 42.4,26.27 41.22,26.27 ; C4.2 18.19,26.6 v2(18.14,26.65)
  Bottom Layer w0.3: v2(37.7,32.37) 37.75,32.32 D3.1 ; v2(37.75,28.98) D4.1
  vias: v2(42.53,26.27)
VBUS: length 43.7
  Top Layer w0.254: USB1.1 39.4,29.82 38.9,29.82 v2(38.4,29.31) ; R7.2 42.7,25.38 v2(42.78,25.38)
  Top Layer w0.3: U1.20 20.68,35.45 20.68,36.43 21.57,37.32 22.65,37.32 C1.1 v2(24.94,33.13) ; U6.3 34.61,39.92 C14.1 C13.1 36.75,38.01 37.06,37.7 37.06,35.54 v1(36.43,34.91)
  Top Layer w0.5: 5.75,24.79 U4.5 6.71,23.48 7.59,22.59 7.59,20.49 C7.1 7.63,20.33 L1.2 7.63,12.78 8.49,11.92 v1(11.28,11.92)
  Bottom Layer w0.254: 39.93,26.02 C12.1 ; 39.93,26.02 39.1,26.02 38.4,26.72 v2(38.4,29.31) ; 39.93,26.02 39.93,24.41 D2.2
CAM_RX: length 40.1
  Top Layer w0.254: 34.13,13.69 34.12,13.7 v2(31.86,13.7) ; v2(23.73,45.45) 23.79,45.51 CN1.4 ; v2(29.06,17.38) 28.68,17.76 v2(28.68,22.46)
  Bottom Layer w0.254: v2(29.06,17.38) 29.06,14.71 30.08,13.7 v2(31.86,13.7) ; v2(28.68,22.46) 28.68,24.11 23.73,29.06 v2(23.73,45.45)
CAM_TX: length 41.3
  Top Layer w0.254: v2(30.59,14.33) 30.59,13.19 31.35,12.42 34.13,12.42 ; v2(30.33,17.38) 29.57,18.14 v2(29.57,22.46) ; CN1.3 v2(26.29,45.45)
  Bottom Layer w0.254: v2(29.57,22.46) 29.57,24.11 24.11,29.57 24.11,41.76 26.29,43.94 v2(26.29,45.45) ; v2(30.59,14.33) 30.59,17.13 v2(30.33,17.38)
D+: length 31.4
  Top Layer w0.254: U5.3 41.94,19.24 42.78,18.4 42.78,17.63 43.03,17.38 43.8,17.38 44.18,17.76 44.18,18.01 44.3,18.14 44.3,21.44 v2(43.92,21.82) ; USB1.3 38.67,31.07 38.55,30.95 37.09,30.95 37,31.04 v2(37,31.34)
  Bottom Layer w0.254: D3.2 35.66,31.34 35.19,30.88 35.19,26.37 34.12,25.3 34.12,23.82 35.25,22.69 43.06,22.69 v2(43.92,21.82)
  Bottom Layer w0.3: v2(37,31.34) D3.2
D-: length 25.9
  Top Layer w0.254: v2(37,30.06) 37,30.46 37.09,30.55 38.55,30.55 38.67,30.42 USB1.2 ; v2(42.36,20.1) 41.98,19.72 41.97,19.72 41.95,19.74 U5.4
  Bottom Layer w0.254: v2(42.36,20.1) 43.21,20.1 44.56,21.44 44.56,22.33 43.8,23.09 35.41,23.09 34.53,23.98 34.53,25.13 35.6,26.2 35.6,29.42 D4.2
  Bottom Layer w0.3: v2(37,30.06) 36.26,30.06 D4.2
DTR: length 6.3
  Top Layer w0.254: Q2.3 40.62,13.5 40.62,15.21 R5.1 40.88,16.24 40.18,16.94 U5.23
EN: length 72
  Top Layer w0.254: U2.3 14.84,23.85 14.59,23.6 14.59,7.15 C2.1 ; U2.3 16.26,23.86 ; U2.3 17.38,23.85 17.63,23.6 17.63,19.67 20.17,17.13 20.17,15.98 21.95,14.2 27.54,14.2 33.51,8.24 v2(35.41,8.24) ; R1.1 13.94,6.4 C2.1 ; C2.1 15.94,6.46 SW1.1 SW1.2 ; Q1.3 v2(43.74,12.47)
  Bottom Layer w0.254: v2(35.41,8.24) 39.5,8.24 v2(43.74,12.47)
ENA: length 26.8
  Top Layer w0.254: U1.23 22.59,33.51 20.81,31.73 v2(20.81,21.57) ; U2.12 v2(18.27,12.42)
  Bottom Layer w0.254: v2(20.81,21.57) 20.81,14.96 v2(18.27,12.42)
ENB: length 29.5
  Top Layer w0.254: v2(21.7,22.08) 21.7,27.92 v2(21.57,28.05) ; U1.15 17.38,35.4 17.38,32.24 v2(17.76,31.86) ; U2.13 v2(18.27,11.15)
  Bottom Layer w0.254: v2(21.7,22.08) 21.44,21.82 21.44,14.33 v2(18.27,11.15) ; v2(21.57,28.05) v2(17.76,31.86)
IN1: length 24.8
  Top Layer w0.254: v2(20.17,22.08) 20.43,22.33 20.43,32.49 21.29,33.36 U1.21 ; U2.11 v2(18.02,13.69)
  Bottom Layer w0.254: v2(18.02,13.69) 20.17,15.85 v2(20.17,22.08)
IN2: length 24.6
  Top Layer w0.254: v2(20.05,33.38) 19.79,33.13 19.79,22.84 v2(19.54,22.59) ; U1.22 v2(21.94,34.4) ; U2.10 v2(18.02,14.96)
  Bottom Layer w0.254: v2(20.05,33.38) 21.32,33.38 21.94,34.01 v2(21.94,34.4) ; v2(19.54,22.59) 19.54,16.49 v2(18.02,14.96)
IN3: length 21.7
  Top Layer w0.254: v2(18.9,21.95) 18.9,23.98 19.28,24.36 19.28,33.64 18.65,34.27 18.65,35.37 U1.17 ; U2.9 v2(18.02,16.23)
  Bottom Layer w0.254: v2(18.02,16.23) 18.9,17.12 v2(18.9,21.95)
IN4: length 20.3
  Top Layer w0.254: v2(18.27,20.81) 18.27,23.98 18.9,24.62 18.9,33.38 18.02,34.27 18.02,35.38 U1.16 ; U2.8 v2(17.89,17.5)
  Bottom Layer w0.254: v2(17.89,17.5) 18.27,17.89 v2(18.27,20.81)
IO0: length 19.1
  Top Layer w0.254: 37.89,11.95 v2(37.89,10.95) 36.83,9.88 U2.25 34.38,9.76 35.54,9.76 36.43,8.87 36.43,6.54 35.93,6.04 SW2.1
IR_OUT: length 53.8
  Top Layer w0.254: 36.81,45.57 v2(36.85,45.61) CN2.3 ; v2(29.83,29.7) 27.03,29.7 24.49,27.16 v2(24.49,26.02) ; v2(31.6,11.16) 34.25,11.16 U2.26
  Bottom Layer w0.254: v2(24.49,26.02) 26.52,23.98 26.52,16.24 v2(31.6,11.16) ; v2(36.85,45.61) 39.73,42.73 39.73,36.18 37.06,33.51 31.99,33.51 29.83,31.35 v2(29.83,29.7)
LED_CLK: length 44.1
  Top Layer w0.254: H1.5 v2(18.19,45.32) ; v2(27.92,17.38) 29.07,16.23 34.13,16.23
  Bottom Layer w0.254: v2(18.19,45.32) 17.05,44.18 16.11,44.18 15.47,43.54 15.47,34.65 15.98,34.14 17.89,34.14 27.92,24.11 v2(27.92,17.38)
LED_CS: length 43.9
  Top Layer w0.254: v2(27.16,17.51) 27.16,17.13 29.32,14.97 34.12,14.97 34.13,14.96 ; H1.4 v2(15.69,45.32)
  Bottom Layer w0.254: v2(27.16,17.51) 27.16,24.11 17.51,33.76 15.86,33.76 14.97,34.65 14.97,44.6 v2(15.69,45.32)
LED_DIN: length 37
  Top Layer w0.254: 34.13,25.12 24.37,25.12 v2(24.37,25.13) ; H1.3 v2(13.19,45.45)
  Bottom Layer w0.254: v2(13.19,45.45) 14.46,44.18 14.46,34.52 15.86,33.13 17.38,33.13 22.33,28.17 22.33,27.16 v2(24.37,25.13)
MOTOR1_+: length 14
  Top Layer w0.254: U1.2 U1.1 23.24,40.89 22.21,39.86 16.87,39.86 16.26,40.47 CN4.1
MOTOR1_-: length 13.1
  Top Layer w0.254: v2(19.67,37.95) 19.65,37.97 CN4.2 ; v2(20.64,41.51) U1.5 19.99,42.53
  Bottom Layer w0.254: v2(19.67,37.95) 20.64,38.93 v2(20.64,41.51)
MOTOR2_+: length 28
  Top Layer w0.254: v2(16.75,38.84) 17.1,38.48 22.06,38.48 24.75,35.79 25.13,35.79 v2(25.51,36.18) ; v2(16.74,41.38) U1.11 U1.12
  Bottom Layer w0.254: v2(16.75,38.84) 16.75,41.38 v2(16.74,41.38) ; CN6.1 27.43,38.1 v2(25.51,36.18)
MOTOR2_-: length 23.8
  Top Layer w0.254: U1.8 U1.7 v2(19.34,41.38) ; v2(24.87,41.51) 22.59,39.22 v2(19.92,39.22)
  Bottom Layer w0.254: v2(19.34,41.38) 19.34,39.8 v2(19.92,39.22) ; CN6.2 37.3,41.51 v2(24.87,41.51)
RTS: length 10.9
  Top Layer w0.254: U5.19 v2(37.57,17.49) ; Q1.2 40.86,11.92 39.35,11.92 39.1,12.17 39.1,13.95 39.68,14.53 R6.1 39.68,15.91 v2(39.48,16.11)
  Bottom Layer w0.254: v2(39.48,16.11) 38.21,16.11 37.57,16.74 v2(37.57,17.49)
RXD: length 10.9
  Top Layer w0.3: U5.20 38.68,16.94 38.48,16.74 36.81,16.74 v2(36.56,17)
  Bottom Layer w0.3: R2.2 30.84,19.79 31.73,18.9 34.65,18.9 v2(36.56,17)
RXD0: length 5.6
  Top Layer w0.3: 34.13,21.31 34,21.19 v2(32.37,21.19)
  Bottom Layer w0.3: v2(32.37,21.19) 31.86,21.7 30.22,21.7 R3.1
SERVO1_PWM: length 35.7
  Top Layer w0.254: U2.36 27.41,23.85 v2(25.76,22.21)
  Bottom Layer w0.254: v2(25.76,22.21) 25.76,20.43 23.09,17.76 23.09,14.71 16.58,8.2 CN3.1
SERVO2_PWM: length 25.3
  Top Layer w0.254: v2(32.62,17.13) 32.62,19.79 32.87,20.05 34.25,20.05 U2.33
  Bottom Layer w0.254: v2(32.62,17.13) 32.62,8.62 34.02,7.22 37.32,7.22 37.95,6.58 37.95,5.61 40.37,3.2 CN5.1
TXD: length 12.3
  Top Layer w0.3: v2(36.56,16.11) 38.59,16.11 39.18,16.7 U5.21
  Bottom Layer w0.3: R3.2 29.96,18.4 34.27,18.4 v2(36.56,16.11)
TXD0: length 3.3
  Top Layer w0.3: v2(32.37,22.59) 34.12,22.59 34.13,22.58
  Bottom Layer w0.3: R2.1 32.23,22.45 v2(32.37,22.59)
$1N12848: length 2.7
  Top Layer w0.254: Q1.1 42.76,14.69 43.03,14.97 43.03,16.12 R5.2
$1N12849: length 1.5
  Top Layer w0.254: Q2.1 38.17,14 R6.2
$1N16217: length 2.9
  Top Layer w0.254: R7.1 R9.2 40.2,21.51 U5.8
$1N16236: length 2.1
  Top Layer w0.254: C9.2 38.74,22.95 39.69,22 39.69,21.5 U5.9
$1N16284: length 4.3
  Top Layer w0.254: U5.16 37.38,19.28 36.81,19.28 36.73,19.36 C8.1
$1N18974: length 5.9
  Top Layer w0.5: 5.75,27.09 5.75,27.74 R10.2 7.73,29.45 R8.1
$1N19007: length 14.7
  Top Layer w0.5: U4.1 9.12,25.62 9.12,20.05 9.5,19.67 11.61,19.67 11.63,19.68 ; L1.1 11.63,19.68 ; 11.63,19.68 D1.2
$1N24133: length 1.5
  Top Layer w0.254: R4.1 9.87,33.74 LED1.2

## Copper pours and planes (outline as drawn; the poured copper is in the pictures)
+3V3 on Top Layer: -4.34,55.61 53.45,55.61 53.45,-5.23 -4.34,-5.23
GND on Bottom Layer: -1.67,52.56 51.03,52.56 51.03,-3.58 -1.67,-3.58
GND on GND: -11.19,63.73 58.4,63.73 58.4,-6.62 -11.19,-6.62
VBUS on PWR: -7.51,59.54 55.61,59.54 55.61,-5.73 -7.51,-5.73
